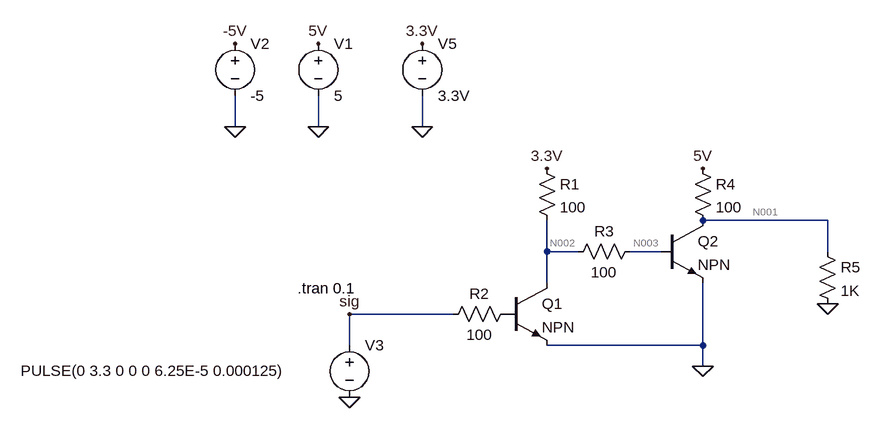
[diagram p0: schematic levelShifter.asc]
levelShifter.asc, the LTspice schematic file:
Version 4
SHEET 1 880 852
WIRE -560 -32 -560 -80
WIRE -432 -32 -432 -80
WIRE -272 -32 -272 -80
WIRE 352 112 160 112
WIRE -80 160 -80 112
WIRE -32 160 -80 160
WIRE 96 160 48 160
WIRE 352 160 352 112
WIRE -80 208 -80 160
WIRE -224 256 -384 256
WIRE -384 304 -384 256
WIRE 160 304 160 208
WIRE 160 304 -80 304
WIRE 160 336 160 304
FLAG -432 -160 5V
FLAG -432 -32 0
FLAG -272 -160 3.3V
FLAG -272 -32 0
FLAG -80 32 3.3V
FLAG 160 336 0
FLAG -384 384 0
FLAG 160 32 5V
FLAG 352 240 0
FLAG -384 256 sig
FLAG -560 -160 -5V
FLAG -560 -32 0
SYMBOL voltage -432 -176 R0
WINDOW 123 0 0 Left 0
WINDOW 39 0 0 Left 0
SYMATTR InstName V1
SYMATTR Value 5
SYMBOL voltage -384 288 R0
WINDOW 3 -506 55 Left 2
WINDOW 123 0 0 Left 0
WINDOW 39 0 0 Left 0
SYMATTR Value PULSE(0 3.3 0 0 0 6.25E-5 0.000125)
SYMATTR InstName V3
SYMBOL voltage -272 -176 R0
WINDOW 123 0 0 Left 0
WINDOW 39 0 0 Left 0
SYMATTR InstName V5
SYMATTR Value 3.3V
SYMBOL npn -144 208 R0
SYMATTR InstName Q1
SYMBOL res -128 240 R90
WINDOW 0 0 56 VBottom 2
WINDOW 3 32 56 VTop 2
SYMATTR InstName R2
SYMATTR Value 100
SYMBOL npn 96 112 R0
SYMATTR InstName Q2
SYMBOL res 64 144 R90
WINDOW 0 0 56 VBottom 2
WINDOW 3 32 56 VTop 2
SYMATTR InstName R3
SYMATTR Value 100
SYMBOL res -96 16 R0
SYMATTR InstName R1
SYMATTR Value 100
SYMBOL res 144 16 R0
SYMATTR InstName R4
SYMATTR Value 100
SYMBOL res 336 144 R0
SYMATTR InstName R5
SYMATTR Value 1K
SYMBOL voltage -560 -176 R0
WINDOW 123 0 0 Left 0
WINDOW 39 0 0 Left 0
SYMATTR InstName V2
SYMATTR Value -5
TEXT -464 216 Left 2 !.tran 0.1

The netlist it stands for:
* levelShifter.asc
V1 5V 0 5
V3 sig 0 PULSE(0 3.3 0 0 0 6.25E-5 0.000125)
V5 3.3V 0 3.3V
Q1 N002 P001 0 0 NPN
R2 P001 sig 100
Q2 N001 N003 0 0 NPN
R3 N003 N002 100
R1 3.3V N002 100
R4 5V N001 100
R5 N001 0 1K
V2 -5V 0 -5
.model NPN NPN
.model PNP PNP
.lib standard.bjt
.tran 0.1
.backanno
.end

* Results of the author's LTspice run, read from the files saved beside the schematic
* Operating Point, zero values left out:
*   V(5v) = 5 V
*   V(3.3v) = 3.3 V
*   V(n002) = 2.092 V
*   V(n001) = 47.84 mV
*   V(n003) = 884.9 mV
*   V(-5v) = -5 V
*   Ic(Q2) = 49.47 mA
*   Ib(Q2) = 12.08 mA
*   Ie(Q2) = -61.55 mA
*   Ic(Q1) = 2.093 pA
*   Ib(Q1) = -2.093 pA
*   I(R5) = 47.84 µA
*   I(R4) = 49.52 mA
*   I(R1) = 12.08 mA
*   I(R3) = -12.08 mA
*   I(R2) = 2.093 pA
*   I(V5) = -12.08 mA
*   I(V3) = 2.093 pA
*   I(V1) = -49.52 mA
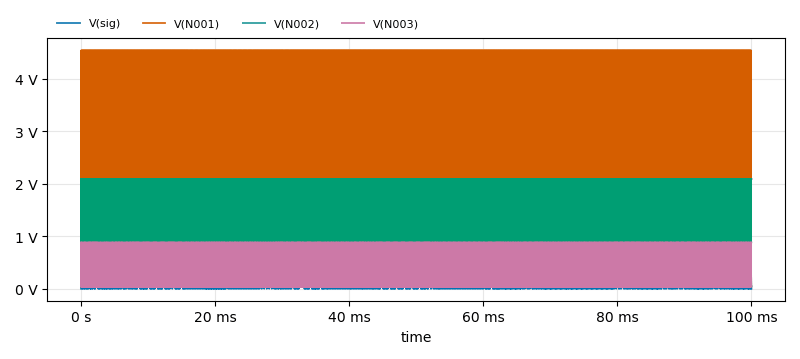
[diagram p1: Transient Analysis of levelShifter.asc, plotted from the saved traces]
* Transient Analysis, 1 run:
*   V(sig): min 0 V, max 3.3 V, average 1.815 V, rms 2.411 V, last 0 V
*   V(N001): min 47.82 mV, max 4.545 V, average 2.63 V, rms 3.439 V, last 47.84 mV
*   V(N002): min 31.63 mV, max 2.092 V, average 909.9 mV, rms 1.362 V, last 2.092 V
*   V(N003): min 31.63 mV, max 884.9 mV, average 396.4 mV, rms 577.2 mV, last 884.9 mV